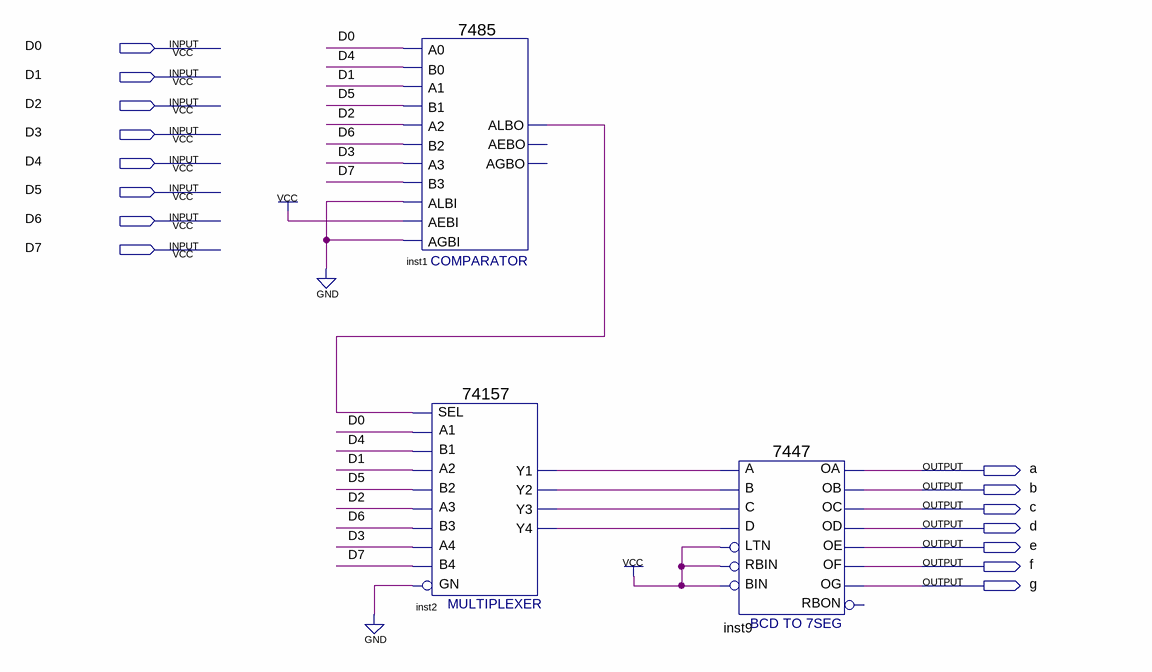
[diagram p0: schematic sheet]
// Quartus schematic Practica_1_B.bdf as structural Verilog: 3 symbols, 15 pins
module Practica_1_B (
  input  D0,
  input  D1,
  input  D2,
  input  D3,
  input  D4,
  input  D5,
  input  D6,
  input  D7,
  output a,
  output b,
  output c,
  output d,
  output e,
  output f,
  output g
);

  wire inst1_albo, inst2_y1, inst2_y2, inst2_y3, inst2_y4;

  \7485  inst1 (
    .A3(D3), .B2(D6), .A2(D2), .AEBI(1'b1), .AGBI(1'b0), .ALBI(1'b0), .A0(D0), .B0(D4), .B3(D7), .A1(D1),
    .B1(D5), .ALBO(inst1_albo));  // open: AGBO, AEBO
  \74157  inst2 (
    .A1(D0), .B1(D4), .SEL(inst1_albo), .B2(D5), .A3(D2), .B3(D6), .A2(D1), .B4(D7), .GN(1'b0), .A4(D3),
    .Y2(inst2_y2), .Y1(inst2_y1), .Y4(inst2_y4), .Y3(inst2_y3));
  \7447  inst9 (
    .LTN(1'b1), .B(inst2_y2), .C(inst2_y3), .D(inst2_y4), .RBIN(1'b1), .BIN(1'b1), .A(inst2_y1), .OB(b),
    .OC(c), .OE(e), .OD(d), .OF(f), .OG(g), .OA(a));  // open: RBON
endmodule
